# EAGLE schematic Ambisonic Clock Decoder With Phase Shifted Crosstalk Cancellation (EAGLE 9.0.1)

## Sheet 1 of 5: CLOCK (1 OF 5) stereo in, uhj decoder, b out
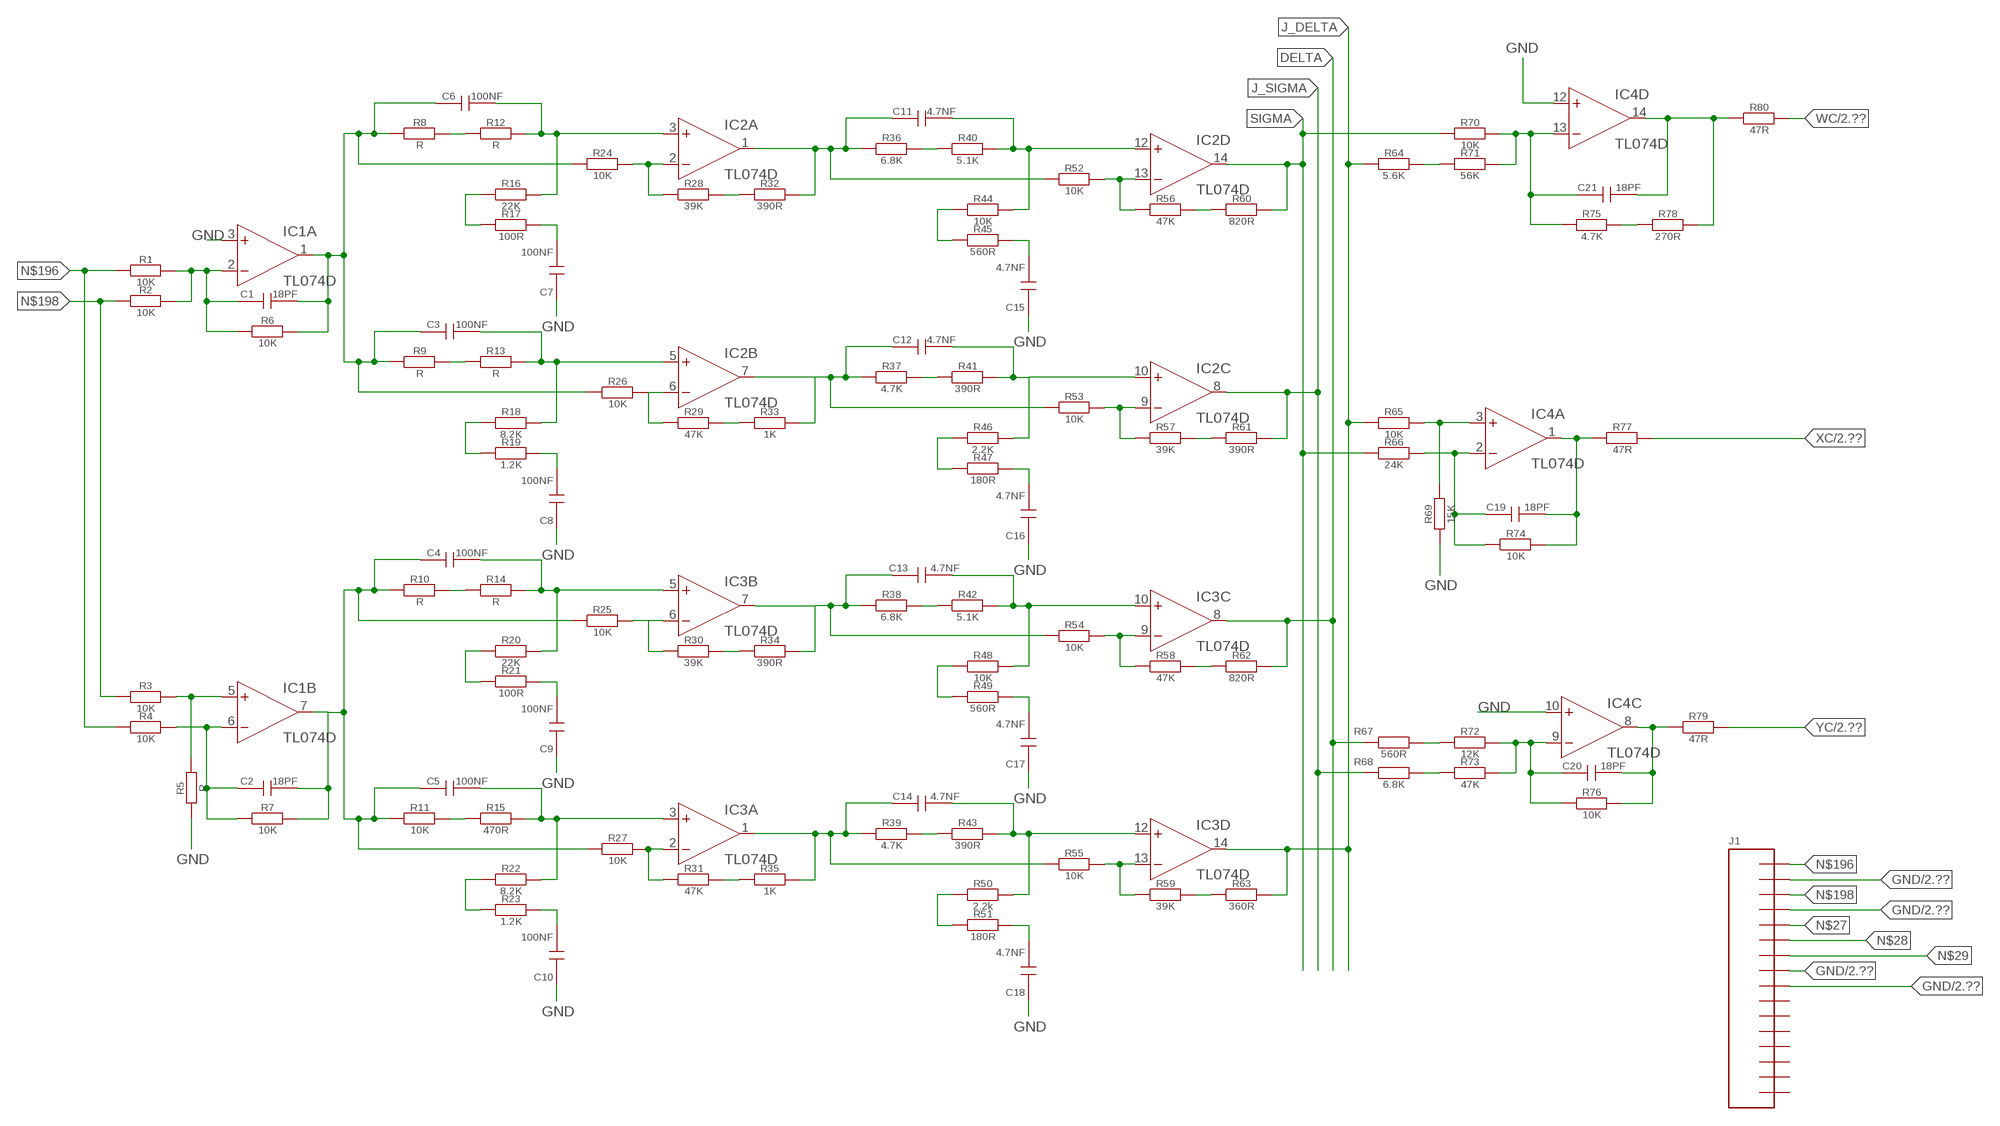
[diagram p0: schematic, sheet 1]

### Parts
C1  18PF  C  [CT6032]
C2  18PF  C  [CT6032]
C3  100NF  C  [CT6032]
C4  100NF  C  [CT6032]
C5  100NF  C  [CT6032]
C6  100NF  C  [CT6032]
C7  100NF  C  [CT6032]
C8  100NF  C  [CT6032]
C9  100NF  C  [CT6032]
C10  100NF  C  [CT6032]
C11  4.7NF  C  [CT6032]
C12  4.7NF  C  [CT6032]
C13  4.7NF  C  [CT6032]
C14  4.7NF  C  [CT6032]
C15  4.7NF  C  [CT6032]
C16  4.7NF  C  [CT6032]
C17  4.7NF  C  [CT6032]
C18  4.7NF  C  [CT6032]
C19  18PF  C  [CT6032]
C20  18PF  C  [CT6032]
C21  18PF  C  [CT6032]
IC1  TL074D  [SO14]
IC2  TL074D  [SO14]
IC3  TL074D  [SO14]
IC4  TL074D  [SO14]
J1  CON_16  [2X08SMT]
R1  10K  R  [R6332W]
R2  10K  R  [R6332W]
R3  10K  R  [R6332W]
R4  10K  R  [R6332W]
R5  R  [R6332W]
R6  10K  R  [R6332W]
R7  10K  R  [R6332W]
R8  R  [R6332W]
R9  R  [R6332W]
R10  R  [R6332W]
R11  10K  R  [R6332W]
R12  R  [R6332W]
R13  R  [R6332W]
R14  R  [R6332W]
R15  470R  R  [R6332W]
R16  22K  R  [R6332W]
R17  100R  R  [R6332W]
R18  8.2K  R  [R6332W]
R19  1.2K  R  [R6332W]
R20  22K  R  [R6332W]
R21  100R  R  [R6332W]
R22  8.2K  R  [R6332W]
R23  1.2K  R  [R6332W]
R24  10K  R  [R6332W]
R25  10K  R  [R6332W]
R26  10K  R  [R6332W]
R27  10K  R  [R6332W]
R28  39K  R  [R6332W]
R29  47K  R  [R6332W]
R30  39K  R  [R6332W]
R31  47K  R  [R6332W]
R32  390R  R  [R6332W]
R33  1K  R  [R6332W]
R34  390R  R  [R6332W]
R35  1K  R  [R6332W]
R36  6.8K  R  [R6332W]
R37  4.7K  R  [R6332W]
R38  6.8K  R  [R6332W]
R39  4.7K  R  [R6332W]
R40  5.1K  R  [R6332W]
R41  390R  R  [R6332W]
R42  5.1K  R  [R6332W]
R43  390R  R  [R6332W]
R44  10K  R  [R6332W]
R45  560R  R  [R6332W]
R46  2.2K  R  [R6332W]
R47  180R  R  [R6332W]
R48  10K  R  [R6332W]
R49  560R  R  [R6332W]
R50  2.2k  R  [R6332W]
R51  180R  R  [R6332W]
R52  10K  R  [R6332W]
R53  10K  R  [R6332W]
R54  10K  R  [R6332W]
R55  10K  R  [R6332W]
R56  47K  R  [R6332W]
R57  39K  R  [R6332W]
R58  47K  R  [R6332W]
R59  39K  R  [R6332W]
R60  820R  R  [R6332W]
R61  390R  R  [R6332W]
R62  820R  R  [R6332W]
R63  360R  R  [R6332W]
R64  5.6K  R  [R6332W]
R65  10K  R  [R6332W]
R66  24K  R  [R6332W]
R67  560R  R  [R6332W]
R68  6.8K  R  [R6332W]
R69  15K  R  [R6332W]
R70  10K  R  [R6332W]
R71  56K  R  [R6332W]
R72  12K  R  [R6332W]
R73  47K  R  [R6332W]
R74  10K  R  [R6332W]
R75  4.7K  R  [R6332W]
R76  10K  R  [R6332W]
R77  47R  R  [R6332W]
R78  270R  R  [R6332W]
R79  47R  R  [R6332W]
R80  47R  R  [R6332W]

### Nets
DELTA: IC3.8(C:OUT) R62.2 R67.1
GND: C7.+ C8.+ C9.+ C10.+ C15.+ C16.+ C17.+ C18.+ IC1.3(A:+IN) IC4.10(C:+IN) IC4.12(D:+IN) J1.2 J1.4 J1.8 J1.9 R5.1 R69.1 ; also sheet 2,4,5
J_DELTA: IC3.14(D:OUT) R63.2 R64.1 R65.1
J_SIGMA: IC2.8(C:OUT) R61.2 R68.1
N$1: R67.2 R72.1
N$2: R68.2 R73.1
N$4: C3.- IC2.5(B:+IN) R13.2 R18.2
N$27: J1.5
N$28: J1.6
N$29: J1.7
N$184: R16.1 R17.1
N$185: R8.2 R12.1
N$186: C7.- R17.2
N$187: C1.+ IC1.2(A:-IN) R1.2 R2.2 R6.1
N$188: C1.- C3.+ C6.+ IC1.1(A:OUT) R6.2 R8.1 R9.1 R24.1 R26.1
N$189: C6.- IC2.3(A:+IN) R12.2 R16.2
N$190: C2.+ IC1.6(B:-IN) R4.2 R7.1
N$191: C19.+ IC4.2(A:-IN) R66.2 R74.1
N$192: R28.2 R32.1
N$193: IC2.2(A:-IN) R24.2 R28.1
N$194: R10.2 R14.1
N$195: C11.+ IC2.1(A:OUT) R32.2 R36.1 R52.1
N$196: J1.1 R1.1 R4.1
N$197: R36.2 R40.1
N$198: J1.3 R2.1 R3.1
N$199: C11.- IC2.12(D:+IN) R40.2 R44.2
N$200: IC1.5(B:+IN) R3.2 R5.2
N$201: R44.1 R45.1
N$202: C15.- R45.2
N$203: IC2.13(D:-IN) R52.2 R56.1
N$204: R56.2 R60.1
N$206: R9.2 R13.1
N$208: R18.1 R19.1
N$209: C8.- R19.2
N$210: IC2.6(B:-IN) R26.2 R29.1
N$211: R29.2 R33.1
N$212: C12.+ IC2.7(B:OUT) R33.2 R37.1 R53.1
N$213: R37.2 R41.1
N$214: C12.- IC2.10(C:+IN) R41.2 R46.2
N$215: R46.1 R47.1
N$216: C16.- R47.2
N$217: IC2.9(C:-IN) R53.2 R57.1
N$218: R57.2 R61.1
N$220: C4.- IC3.5(B:+IN) R14.2 R20.2
N$221: R20.1 R21.1
N$222: C9.- R21.2
N$223: IC3.6(B:-IN) R25.2 R30.1
N$224: R30.2 R34.1
N$225: C13.+ IC3.7(B:OUT) R34.2 R38.1 R54.1
N$226: R38.2 R42.1
N$227: C13.- IC3.10(C:+IN) R42.2 R48.2
N$228: R48.1 R49.1
N$229: C17.- R49.2
N$230: IC3.9(C:-IN) R54.2 R58.1
N$231: R58.2 R62.1
N$233: R11.2 R15.1
N$234: C5.- IC3.3(A:+IN) R15.2 R22.2
N$235: R22.1 R23.1
N$236: C10.- R23.2
N$237: IC3.2(A:-IN) R27.2 R31.1
N$238: R31.2 R35.1
N$239: C14.+ IC3.1(A:OUT) R35.2 R39.1 R55.1
N$240: R39.2 R43.1
N$241: C14.- IC3.12(D:+IN) R43.2 R50.2
N$242: R50.1 R51.1
N$243: C18.- R51.2
N$244: IC3.13(D:-IN) R55.2 R59.1
N$245: R59.2 R63.1
N$247: C2.- C4.+ C5.+ IC1.7(B:OUT) R7.2 R10.1 R11.1 R25.1 R27.1
N$249: R64.2 R71.1
N$250: IC4.3(A:+IN) R65.2 R69.2
N$251: C19.- IC4.1(A:OUT) R74.2 R77.1
N$252: C21.+ IC4.13(D:-IN) R70.2 R71.2 R75.1
N$253: R75.2 R78.1
N$255: C21.- IC4.14(D:OUT) R78.2 R80.1
N$256: C20.+ IC4.9(C:-IN) R72.2 R73.2 R76.1
N$259: C20.- IC4.8(C:OUT) R76.2 R79.1
SIGMA: IC2.14(D:OUT) R60.2 R66.1 R70.1
WC: R80.2 ; also sheet 2,4
XC: R77.2 ; also sheet 2,4
YC: R79.2 ; also sheet 2,4
Unconnected: IC1.8(C:OUT) IC1.9(C:-IN) IC1.10(C:+IN) IC1.12(D:+IN) IC1.13(D:-IN) IC1.14(D:OUT) IC4.5(B:+IN) IC4.6(B:-IN) IC4.7(B:OUT) J1.10 J1.11 J1.12 J1.13 J1.14 J1.15 J1.16

## Sheet 2 of 5: CLOCK (2 OF 5) speaker phase shifters
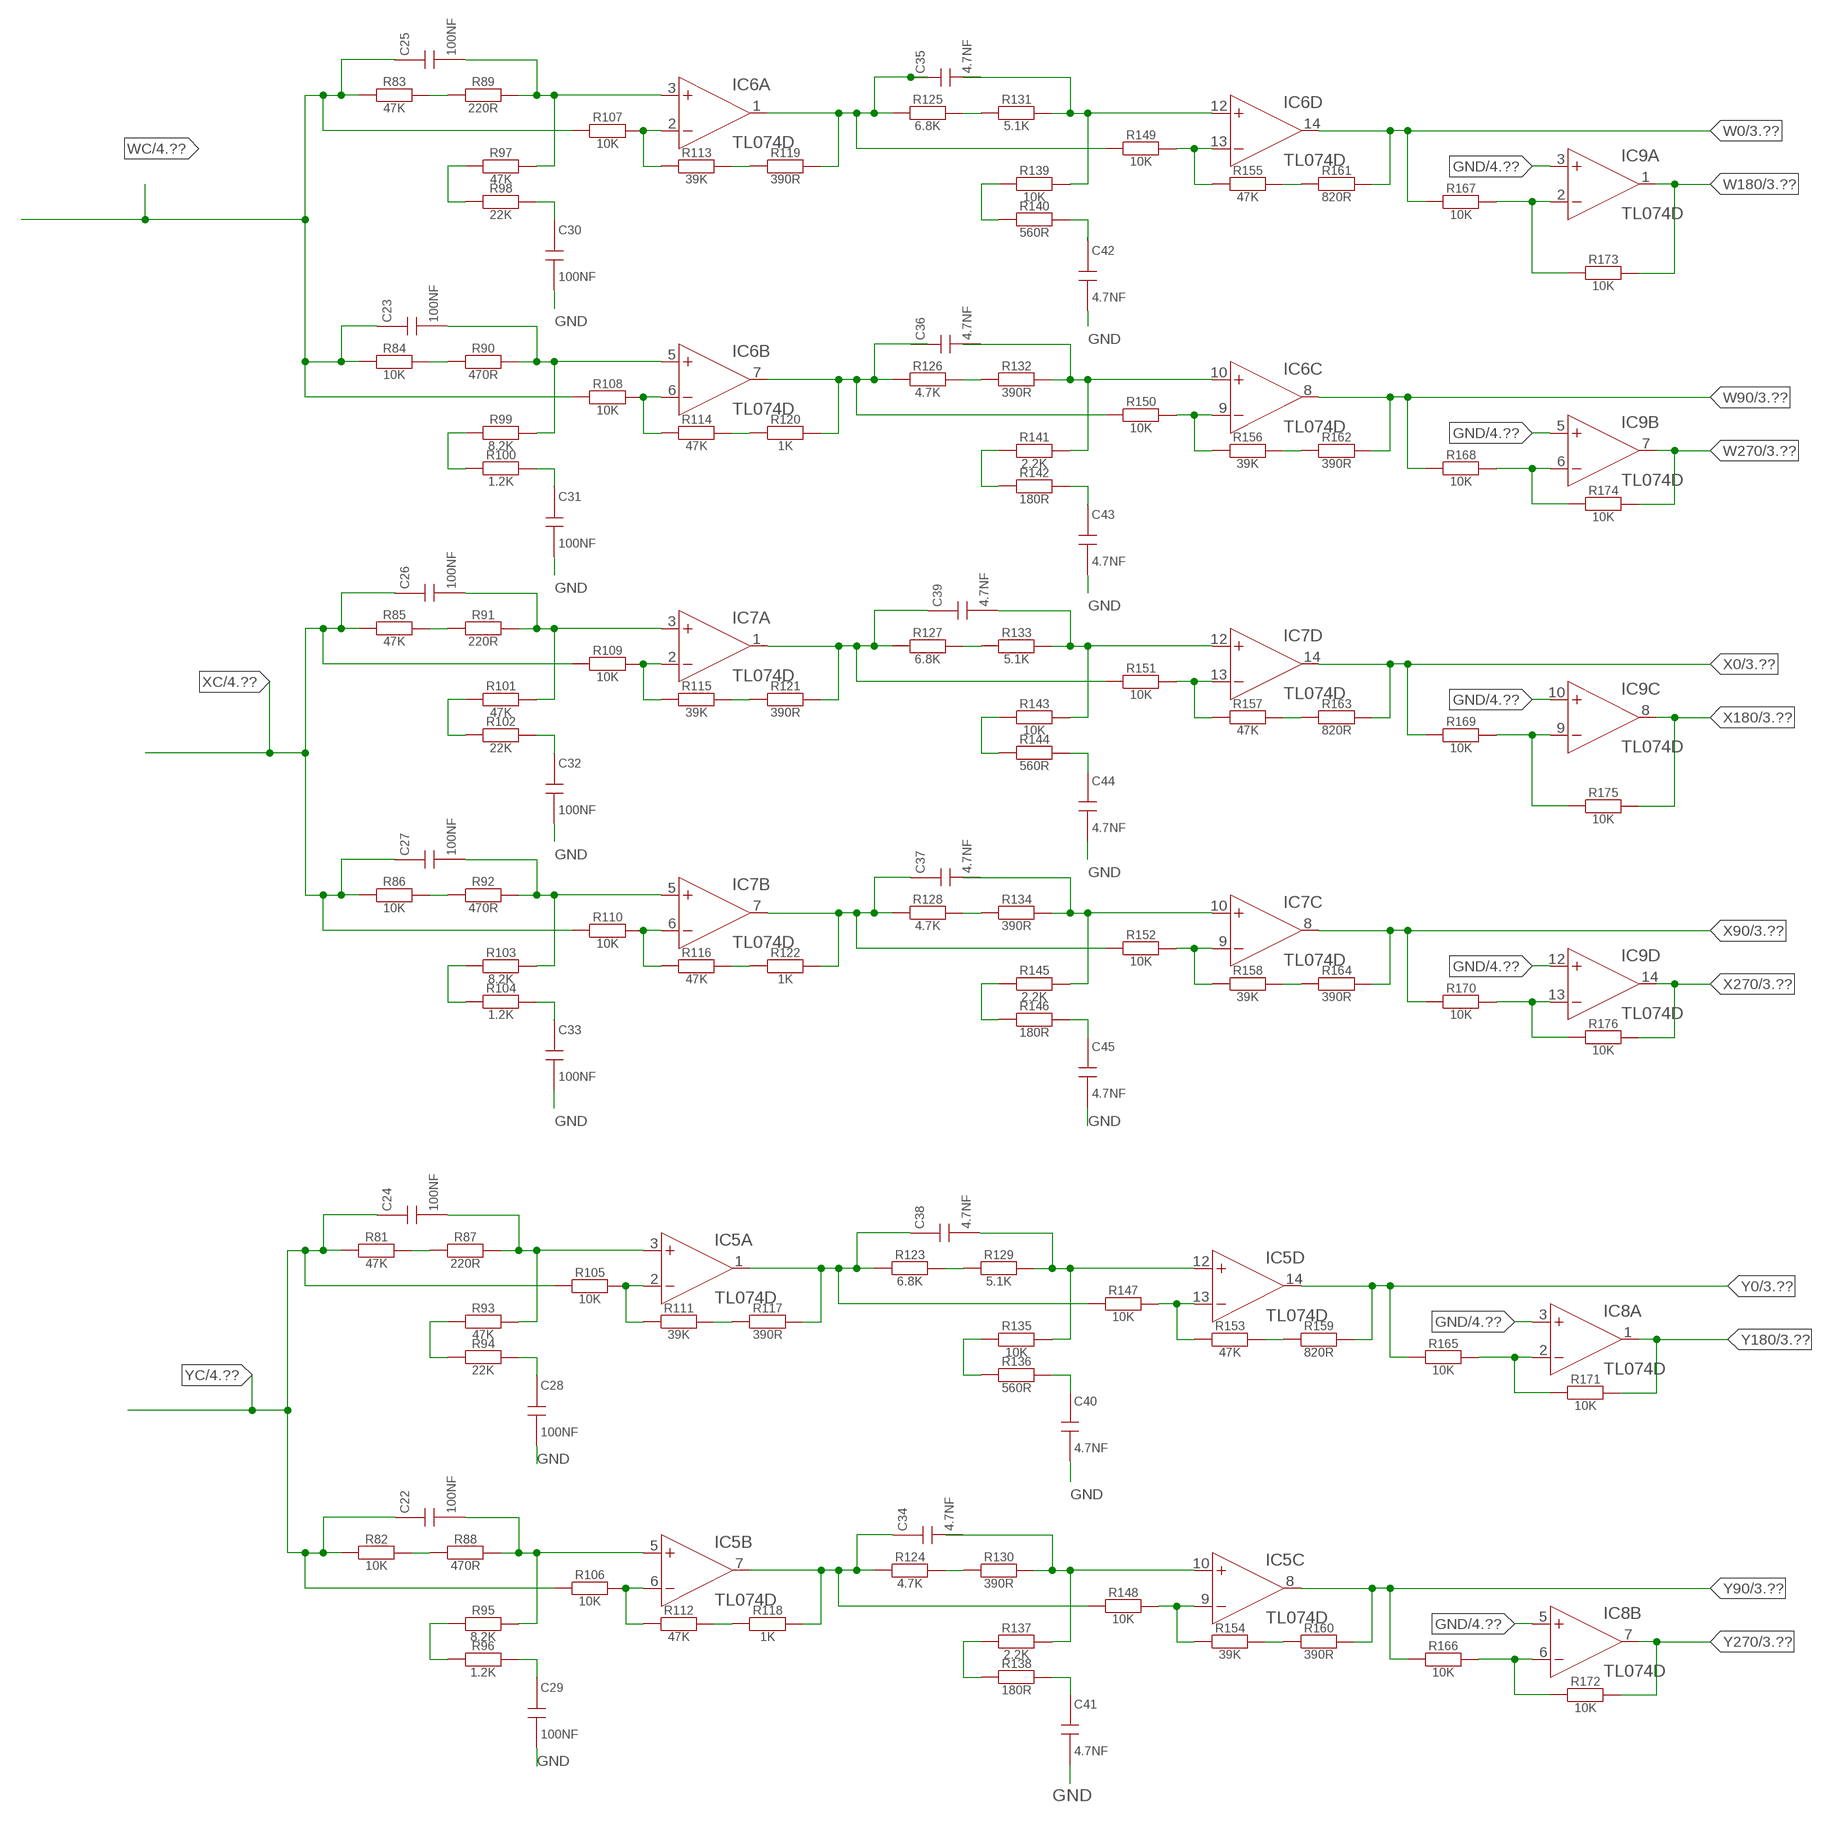
[diagram p1: schematic, sheet 2]

### Parts
C22  100NF  C  [CT6032]
C23  100NF  C  [CT6032]
C24  100NF  C  [CT6032]
C25  100NF  C  [CT6032]
C26  100NF  C  [CT6032]
C27  100NF  C  [CT6032]
C28  100NF  C  [CT6032]
C29  100NF  C  [CT6032]
C30  100NF  C  [CT6032]
C31  100NF  C  [CT6032]
C32  100NF  C  [CT6032]
C33  100NF  C  [CT6032]
C34  4.7NF  C  [CT6032]
C35  4.7NF  C  [CT6032]
C36  4.7NF  C  [CT6032]
C37  4.7NF  C  [CT6032]
C38  4.7NF  C  [CT6032]
C39  4.7NF  C  [CT6032]
C40  4.7NF  C  [CT6032]
C41  4.7NF  C  [CT6032]
C42  4.7NF  C  [CT6032]
C43  4.7NF  C  [CT6032]
C44  4.7NF  C  [CT6032]
C45  4.7NF  C  [CT6032]
IC5  TL074D  [SO14]
IC6  TL074D  [SO14]
IC7  TL074D  [SO14]
IC8  TL074D  [SO14]
IC9  TL074D  [SO14]
R81  47K  R  [R6332W]
R82  10K  R  [R6332W]
R83  47K  R  [R6332W]
R84  10K  R  [R6332W]
R85  47K  R  [R6332W]
R86  10K  R  [R6332W]
R87  220R  R  [R6332W]
R88  470R  R  [R6332W]
R89  220R  R  [R6332W]
R90  470R  R  [R6332W]
R91  220R  R  [R6332W]
R92  470R  R  [R6332W]
R93  47K  R  [R6332W]
R94  22K  R  [R6332W]
R95  8.2K  R  [R6332W]
R96  1.2K  R  [R6332W]
R97  47K  R  [R6332W]
R98  22K  R  [R6332W]
R99  8.2K  R  [R6332W]
R100  1.2K  R  [R6332W]
R101  47K  R  [R6332W]
R102  22K  R  [R6332W]
R103  8.2K  R  [R6332W]
R104  1.2K  R  [R6332W]
R105  10K  R  [R6332W]
R106  10K  R  [R6332W]
R107  10K  R  [R6332W]
R108  10K  R  [R6332W]
R109  10K  R  [R6332W]
R110  10K  R  [R6332W]
R111  39K  R  [R6332W]
R112  47K  R  [R6332W]
R113  39K  R  [R6332W]
R114  47K  R  [R6332W]
R115  39K  R  [R6332W]
R116  47K  R  [R6332W]
R117  390R  R  [R6332W]
R118  1K  R  [R6332W]
R119  390R  R  [R6332W]
R120  1K  R  [R6332W]
R121  390R  R  [R6332W]
R122  1K  R  [R6332W]
R123  6.8K  R  [R6332W]
R124  4.7K  R  [R6332W]
R125  6.8K  R  [R6332W]
R126  4.7K  R  [R6332W]
R127  6.8K  R  [R6332W]
R128  4.7K  R  [R6332W]
R129  5.1K  R  [R6332W]
R130  390R  R  [R6332W]
R131  5.1K  R  [R6332W]
R132  390R  R  [R6332W]
R133  5.1K  R  [R6332W]
R134  390R  R  [R6332W]
R135  10K  R  [R6332W]
R136  560R  R  [R6332W]
R137  2.2K  R  [R6332W]
R138  180R  R  [R6332W]
R139  10K  R  [R6332W]
R140  560R  R  [R6332W]
R141  2.2K  R  [R6332W]
R142  180R  R  [R6332W]
R143  10K  R  [R6332W]
R144  560R  R  [R6332W]
R145  2.2K  R  [R6332W]
R146  180R  R  [R6332W]
R147  10K  R  [R6332W]
R148  10K  R  [R6332W]
R149  10K  R  [R6332W]
R150  10K  R  [R6332W]
R151  10K  R  [R6332W]
R152  10K  R  [R6332W]
R153  47K  R  [R6332W]
R154  39K  R  [R6332W]
R155  47K  R  [R6332W]
R156  39K  R  [R6332W]
R157  47K  R  [R6332W]
R158  39K  R  [R6332W]
R159  820R  R  [R6332W]
R160  390R  R  [R6332W]
R161  820R  R  [R6332W]
R162  390R  R  [R6332W]
R163  820R  R  [R6332W]
R164  390R  R  [R6332W]
R165  10K  R  [R6332W]
R166  10K  R  [R6332W]
R167  10K  R  [R6332W]
R168  10K  R  [R6332W]
R169  10K  R  [R6332W]
R170  10K  R  [R6332W]
R171  10K  R  [R6332W]
R172  10K  R  [R6332W]
R173  10K  R  [R6332W]
R174  10K  R  [R6332W]
R175  10K  R  [R6332W]
R176  10K  R  [R6332W]

### Nets
GND: C28.- C29.- C30.- C31.- C32.- C33.- C40.- C41.- C42.- C43.- C44.- C45.- IC8.3(A:+IN) IC8.5(B:+IN) IC9.3(A:+IN) IC9.5(B:+IN) IC9.10(C:+IN) IC9.12(D:+IN) ; also sheet 1,4,5
N$25: R82.2 R88.1
N$31: R95.1 R96.1
N$32: C29.+ R96.2
N$40: IC5.6(B:-IN) R106.2 R112.1
N$42: R112.2 R118.1
N$43: C34.+ IC5.7(B:OUT) R118.2 R124.1 R148.1
N$51: R124.2 R130.1
N$61: R137.1 R138.1
N$62: C41.+ R138.2
N$67: IC5.9(C:-IN) R148.2 R154.1
N$68: R154.2 R160.1
N$80: R81.2 R87.1
N$89: R93.1 R94.1
N$95: C28.+ R94.2
N$100: IC5.2(A:-IN) R105.2 R111.1
N$121: R111.2 R117.1
N$126: C38.+ IC5.1(A:OUT) R117.2 R123.1 R147.1
N$130: R123.2 R129.1
N$148: R135.1 R136.1
N$153: C40.+ R136.2
N$161: IC5.13(D:-IN) R147.2 R153.1
N$168: R153.2 R159.1
N$170: R84.2 R90.1
N$205: R99.1 R100.1
N$232: C31.+ R100.2
N$246: IC6.6(B:-IN) R108.2 R114.1
N$260: R114.2 R120.1
N$261: C36.+ IC6.7(B:OUT) R120.2 R126.1 R150.1
N$262: R126.2 R132.1
N$264: R141.1 R142.1
N$265: C43.+ R142.2
N$266: IC6.9(C:-IN) R150.2 R156.1
N$267: R156.2 R162.1
N$269: R83.2 R89.1
N$271: R97.1 R98.1
N$272: IC8.6(B:-IN) R166.2 R172.1
N$273: C30.+ R98.2
N$274: IC6.2(A:-IN) R107.2 R113.1
N$275: R113.2 R119.1
N$276: C35.+ IC6.1(A:OUT) R119.2 R125.1 R149.1
N$277: R125.2 R131.1
N$279: R139.1 R140.1
N$280: C42.+ R140.2
N$281: IC6.13(D:-IN) R149.2 R155.1
N$282: R155.2 R161.1
N$289: IC8.2(A:-IN) R165.2 R171.1
N$291: R86.2 R92.1
N$292: C27.- IC7.5(B:+IN) R92.2 R103.2
N$293: R103.1 R104.1
N$294: C33.+ R104.2
N$295: IC7.6(B:-IN) R110.2 R116.1
N$296: R116.2 R122.1
N$297: C37.+ IC7.7(B:OUT) R122.2 R128.1 R152.1
N$298: R128.2 R134.1
N$300: R145.1 R146.1
N$301: C45.+ R146.2
N$302: IC7.9(C:-IN) R152.2 R158.1
N$303: R158.2 R164.1
N$306: IC9.13(D:-IN) R170.2 R176.1
N$308: R85.2 R91.1
N$310: R101.1 R102.1
N$311: C32.+ R102.2
N$312: IC7.2(A:-IN) R109.2 R115.1
N$313: R115.2 R121.1
N$314: C39.+ IC7.1(A:OUT) R121.2 R127.1 R151.1
N$315: R127.2 R133.1
N$317: R143.1 R144.1
N$318: C44.+ R144.2
N$319: IC7.13(D:-IN) R151.2 R157.1
N$320: R157.2 R163.1
N$322: IC9.9(C:-IN) R169.2 R175.1
N$338: IC9.6(B:-IN) R168.2 R174.1
N$354: IC9.2(A:-IN) R167.2 R173.1
N$777: C26.- IC7.3(A:+IN) R91.2 R101.2
N$778: C22.- IC5.5(B:+IN) R88.2 R95.2
N$779: C24.- IC5.3(A:+IN) R87.2 R93.2
N$780: C23.- IC6.5(B:+IN) R90.2 R99.2
N$781: C25.- IC6.3(A:+IN) R89.2 R97.2
N$782: C35.- IC6.12(D:+IN) R131.2 R139.2
N$783: C36.- IC6.10(C:+IN) R132.2 R141.2
N$784: C38.- IC5.12(D:+IN) R129.2 R135.2
N$785: C34.- IC5.10(C:+IN) R130.2 R137.2
N$787: C37.- IC7.10(C:+IN) R134.2 R145.2
N$788: C39.- IC7.12(D:+IN) R133.2 R143.2
W0: IC6.14(D:OUT) R161.2 R167.1 ; also sheet 3
W90: IC6.8(C:OUT) R162.2 R168.1 ; also sheet 3
W180: IC9.1(A:OUT) R173.2 ; also sheet 3
W270: IC9.7(B:OUT) R174.2 ; also sheet 3
WC: C23.+ C25.+ R83.1 R84.1 R107.1 R108.1 ; also sheet 1,4
X0: IC7.14(D:OUT) R163.2 R169.1 ; also sheet 3
X90: IC7.8(C:OUT) R164.2 R170.1 ; also sheet 3
X180: IC9.8(C:OUT) R175.2 ; also sheet 3
X270: IC9.14(D:OUT) R176.2 ; also sheet 3
XC: C26.+ C27.+ R85.1 R86.1 R109.1 R110.1 ; also sheet 1,4
Y0: IC5.14(D:OUT) R159.2 R165.1 ; also sheet 3
Y90: IC5.8(C:OUT) R160.2 R166.1 ; also sheet 3
Y180: IC8.1(A:OUT) R171.2 ; also sheet 3
Y270: IC8.7(B:OUT) R172.2 ; also sheet 3
YC: C22.+ C24.+ R81.1 R82.1 R105.1 R106.1 ; also sheet 1,4
Unconnected: IC8.8(C:OUT) IC8.9(C:-IN) IC8.10(C:+IN) IC8.12(D:+IN) IC8.13(D:-IN) IC8.14(D:OUT)

## Sheet 3 of 5: CLOCK (3 OF 5) phase shifted speaker feed resistor matrix
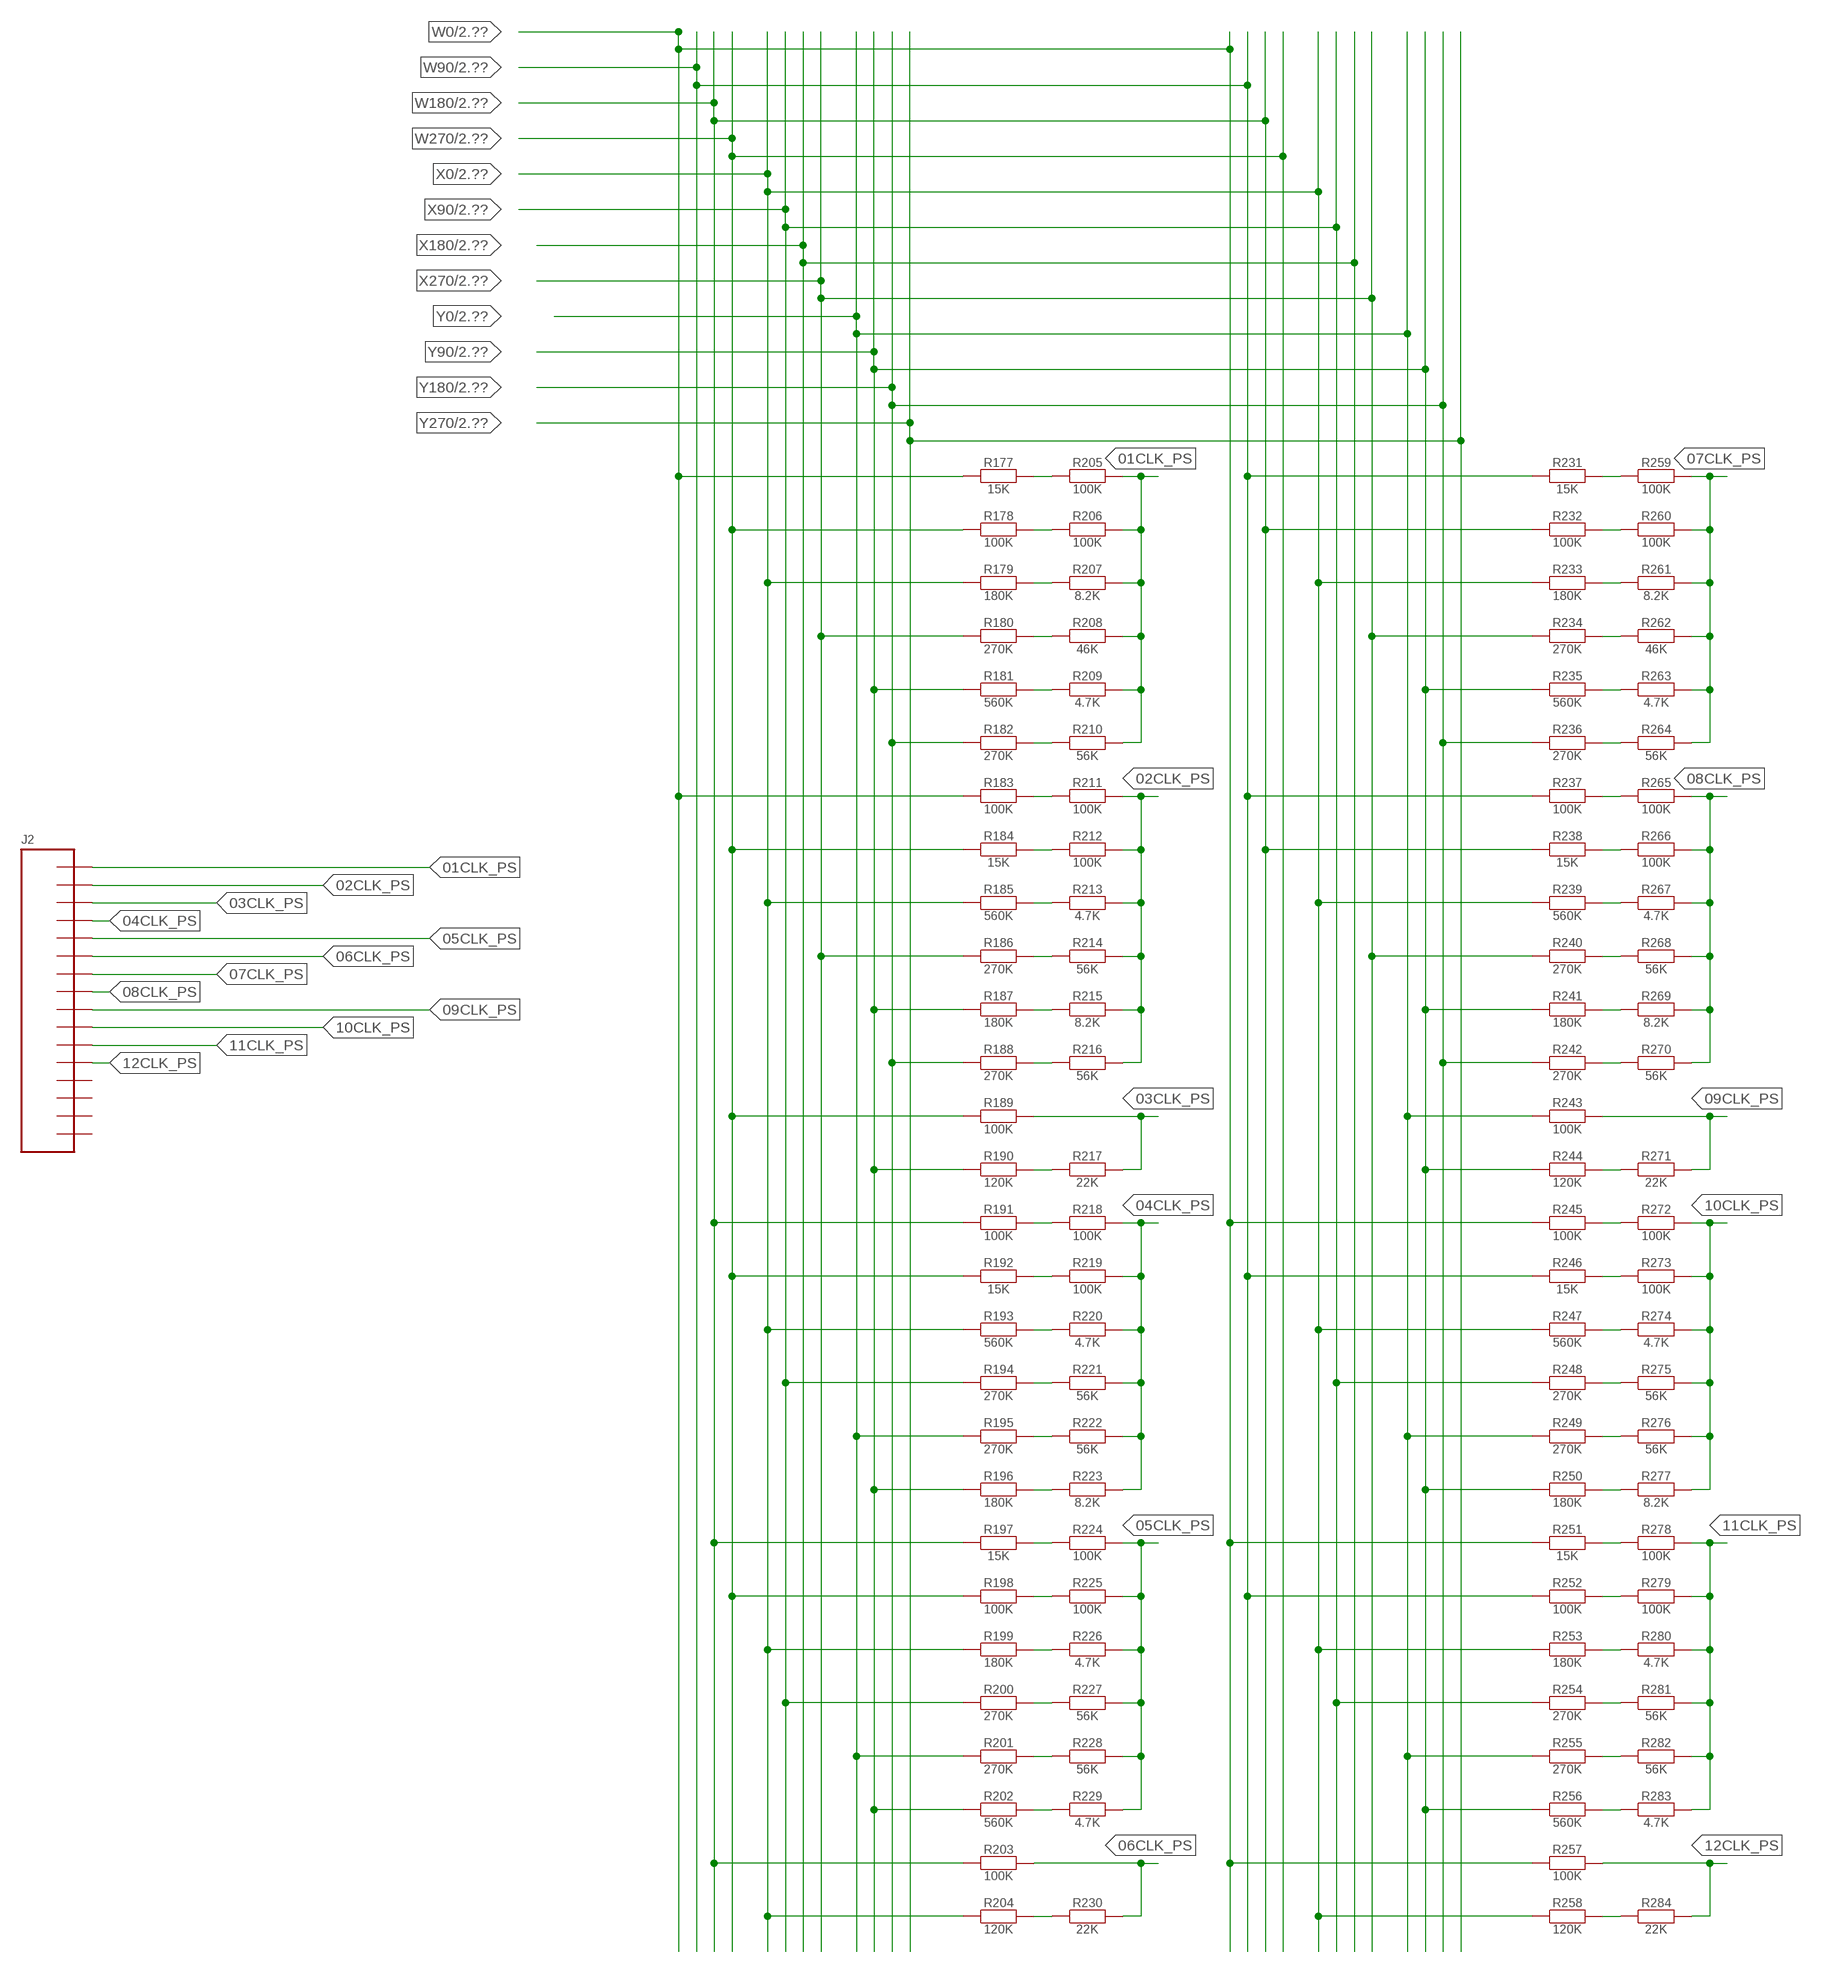
[diagram p2: schematic, sheet 3]

### Parts
J2  CON_16  [2X08SMT]
R177  15K  R  [R6332W]
R178  100K  R  [R6332W]
R179  180K  R  [R6332W]
R180  270K  R  [R6332W]
R181  560K  R  [R6332W]
R182  270K  R  [R6332W]
R183  100K  R  [R6332W]
R184  15K  R  [R6332W]
R185  560K  R  [R6332W]
R186  270K  R  [R6332W]
R187  180K  R  [R6332W]
R188  270K  R  [R6332W]
R189  100K  R  [R6332W]
R190  120K  R  [R6332W]
R191  100K  R  [R6332W]
R192  15K  R  [R6332W]
R193  560K  R  [R6332W]
R194  270K  R  [R6332W]
R195  270K  R  [R6332W]
R196  180K  R  [R6332W]
R197  15K  R  [R6332W]
R198  100K  R  [R6332W]
R199  180K  R  [R6332W]
R200  270K  R  [R6332W]
R201  270K  R  [R6332W]
R202  560K  R  [R6332W]
R203  100K  R  [R6332W]
R204  120K  R  [R6332W]
R205  100K  R  [R6332W]
R206  100K  R  [R6332W]
R207  8.2K  R  [R6332W]
R208  46K  R  [R6332W]
R209  4.7K  R  [R6332W]
R210  56K  R  [R6332W]
R211  100K  R  [R6332W]
R212  100K  R  [R6332W]
R213  4.7K  R  [R6332W]
R214  56K  R  [R6332W]
R215  8.2K  R  [R6332W]
R216  56K  R  [R6332W]
R217  22K  R  [R6332W]
R218  100K  R  [R6332W]
R219  100K  R  [R6332W]
R220  4.7K  R  [R6332W]
R221  56K  R  [R6332W]
R222  56K  R  [R6332W]
R223  8.2K  R  [R6332W]
R224  100K  R  [R6332W]
R225  100K  R  [R6332W]
R226  4.7K  R  [R6332W]
R227  56K  R  [R6332W]
R228  56K  R  [R6332W]
R229  4.7K  R  [R6332W]
R230  22K  R  [R6332W]
R231  15K  R  [R6332W]
R232  100K  R  [R6332W]
R233  180K  R  [R6332W]
R234  270K  R  [R6332W]
R235  560K  R  [R6332W]
R236  270K  R  [R6332W]
R237  100K  R  [R6332W]
R238  15K  R  [R6332W]
R239  560K  R  [R6332W]
R240  270K  R  [R6332W]
R241  180K  R  [R6332W]
R242  270K  R  [R6332W]
R243  100K  R  [R6332W]
R244  120K  R  [R6332W]
R245  100K  R  [R6332W]
R246  15K  R  [R6332W]
R247  560K  R  [R6332W]
R248  270K  R  [R6332W]
R249  270K  R  [R6332W]
R250  180K  R  [R6332W]
R251  15K  R  [R6332W]
R252  100K  R  [R6332W]
R253  180K  R  [R6332W]
R254  270K  R  [R6332W]
R255  270K  R  [R6332W]
R256  560K  R  [R6332W]
R257  100K  R  [R6332W]
R258  120K  R  [R6332W]
R259  100K  R  [R6332W]
R260  100K  R  [R6332W]
R261  8.2K  R  [R6332W]
R262  46K  R  [R6332W]
R263  4.7K  R  [R6332W]
R264  56K  R  [R6332W]
R265  100K  R  [R6332W]
R266  100K  R  [R6332W]
R267  4.7K  R  [R6332W]
R268  56K  R  [R6332W]
R269  8.2K  R  [R6332W]
R270  56K  R  [R6332W]
R271  22K  R  [R6332W]
R272  100K  R  [R6332W]
R273  100K  R  [R6332W]
R274  4.7K  R  [R6332W]
R275  56K  R  [R6332W]
R276  56K  R  [R6332W]
R277  8.2K  R  [R6332W]
R278  100K  R  [R6332W]
R279  100K  R  [R6332W]
R280  4.7K  R  [R6332W]
R281  56K  R  [R6332W]
R282  56K  R  [R6332W]
R283  4.7K  R  [R6332W]
R284  22K  R  [R6332W]

### Nets
01CLK_PS: J2.1 R205.2 R206.2 R207.2 R208.2 R209.2 R210.2
02CLK_PS: J2.2 R211.2 R212.2 R213.2 R214.2 R215.2 R216.2
03CLK_PS: J2.3 R189.2 R217.2
04CLK_PS: J2.4 R218.2 R219.2 R220.2 R221.2 R222.2 R223.2
05CLK_PS: J2.5 R224.2 R225.2 R226.2 R227.2 R228.2 R229.2
06CLK_PS: J2.6 R203.2 R230.2
07CLK_PS: J2.7 R259.2 R260.2 R261.2 R262.2 R263.2 R264.2
08CLK_PS: J2.8 R265.2 R266.2 R267.2 R268.2 R269.2 R270.2
09CLK_PS: J2.9 R243.2 R271.2
10CLK_PS: J2.10 R272.2 R273.2 R274.2 R275.2 R276.2 R277.2
11CLK_PS: J2.11 R278.2 R279.2 R280.2 R281.2 R282.2 R283.2
12CLK_PS: J2.12 R257.2 R284.2
N$26: R237.2 R265.1
N$146: R238.2 R266.1
N$254: R239.2 R267.1
N$257: R240.2 R268.1
N$263: R241.2 R269.1
N$270: R242.2 R270.1
N$288: R244.2 R271.1
N$299: R231.2 R259.1
N$305: R232.2 R260.1
N$307: R233.2 R261.1
N$316: R234.2 R262.1
N$321: R235.2 R263.1
N$323: R236.2 R264.1
N$324: R251.2 R278.1
N$325: R252.2 R279.1
N$326: R253.2 R280.1
N$327: R254.2 R281.1
N$328: R255.2 R282.1
N$329: R256.2 R283.1
N$330: R258.2 R284.1
N$331: R245.2 R272.1
N$332: R246.2 R273.1
N$333: R247.2 R274.1
N$334: R248.2 R275.1
N$335: R249.2 R276.1
N$336: R250.2 R277.1
N$360: R183.2 R211.1
N$361: R184.2 R212.1
N$366: R185.2 R213.1
N$367: R186.2 R214.1
N$372: R187.2 R215.1
N$373: R188.2 R216.1
N$379: R190.2 R217.1
N$385: R177.2 R205.1
N$386: R178.2 R206.1
N$391: R179.2 R207.1
N$392: R180.2 R208.1
N$397: R181.2 R209.1
N$398: R182.2 R210.1
N$404: R197.2 R224.1
N$405: R198.2 R225.1
N$410: R199.2 R226.1
N$411: R200.2 R227.1
N$416: R201.2 R228.1
N$417: R202.2 R229.1
N$423: R204.2 R230.1
N$431: R191.2 R218.1
N$432: R192.2 R219.1
N$437: R193.2 R220.1
N$438: R194.2 R221.1
N$443: R195.2 R222.1
N$444: R196.2 R223.1
W0: R177.1 R183.1 R245.1 R251.1 R257.1 ; also sheet 2
W90: R231.1 R237.1 R246.1 R252.1 ; also sheet 2
W180: R191.1 R197.1 R203.1 R232.1 R238.1 ; also sheet 2
W270: R178.1 R184.1 R189.1 R192.1 R198.1 ; also sheet 2
X0: R179.1 R185.1 R193.1 R199.1 R204.1 R233.1 R239.1 R247.1 R253.1 R258.1 ; also sheet 2
X90: R194.1 R200.1 R248.1 R254.1 ; also sheet 2
X270: R180.1 R186.1 R234.1 R240.1 ; also sheet 2
Y0: R195.1 R201.1 R243.1 R249.1 R255.1 ; also sheet 2
Y90: R181.1 R187.1 R190.1 R196.1 R202.1 R235.1 R241.1 R244.1 R250.1 R256.1 ; also sheet 2
Y180: R182.1 R188.1 R236.1 R242.1 ; also sheet 2
Unconnected: J2.13 J2.14 J2.15 J2.16

## Sheet 4 of 5: CLOCK (4 OF 5) Normal Speaker Feed Resistor Matrix
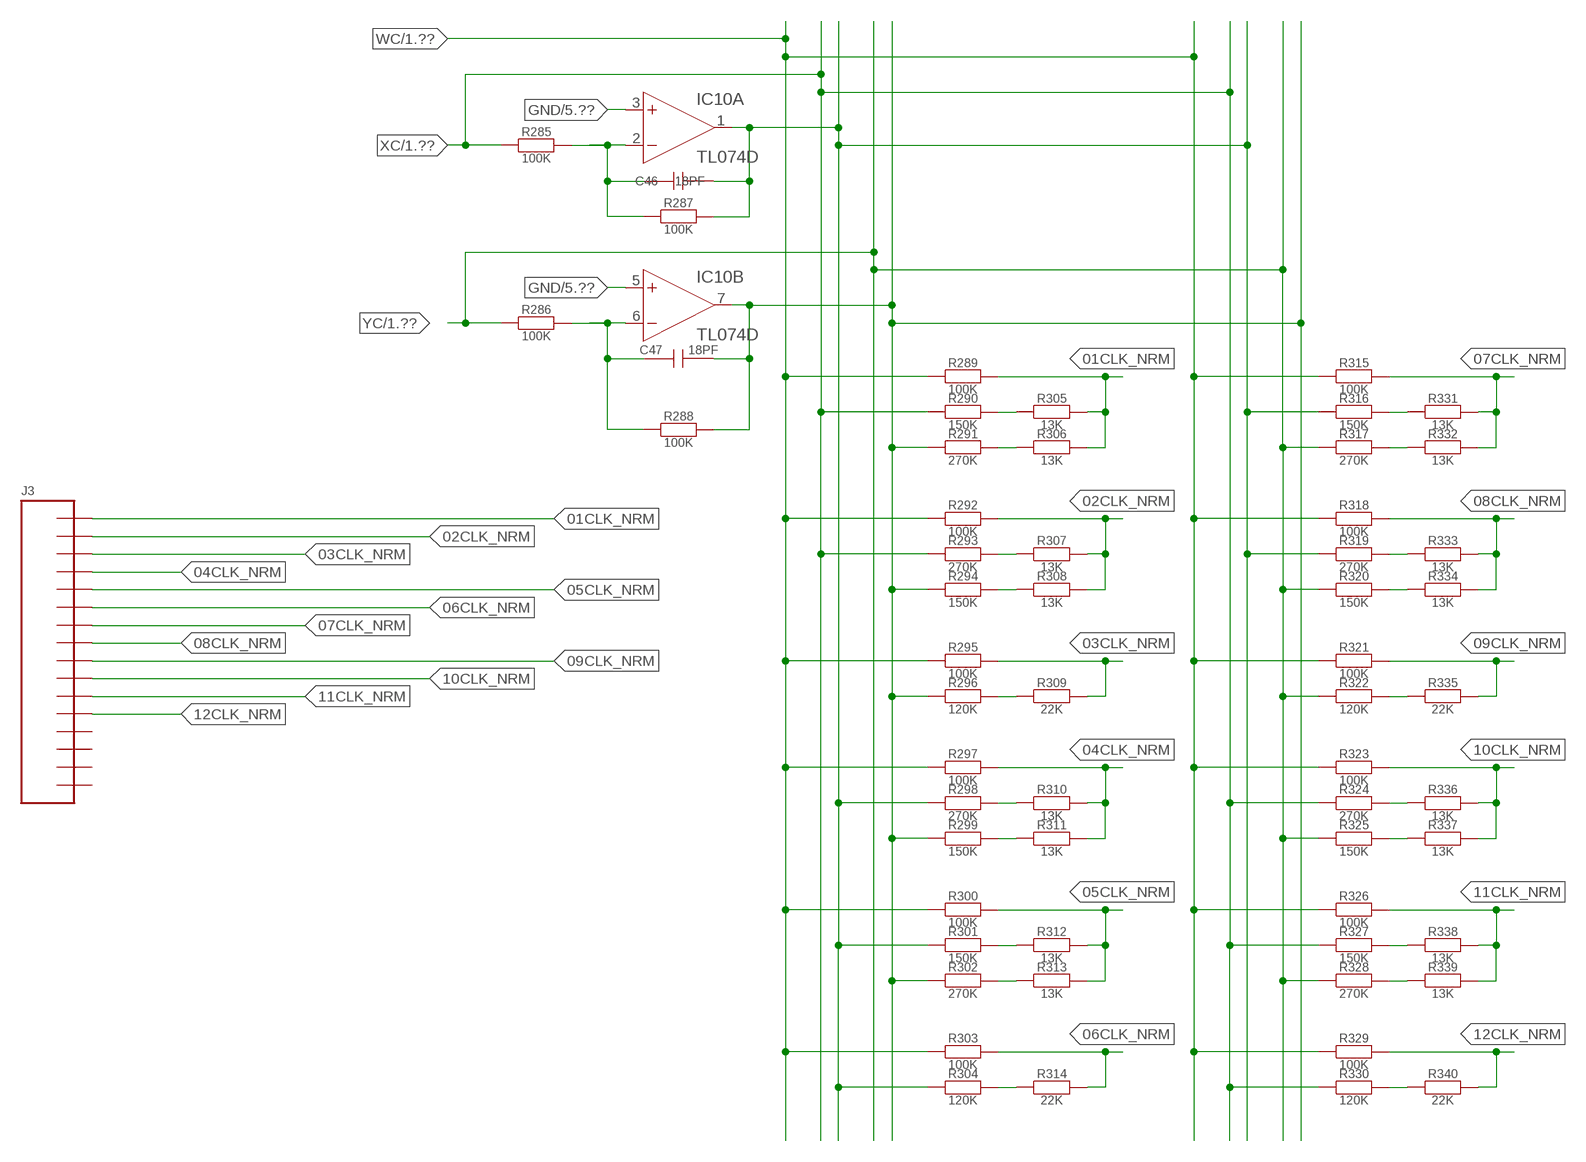
[diagram p3: schematic, sheet 4]

### Parts
C46  18PF  C  [CT6032]
C47  18PF  C  [CT6032]
IC10  TL074D  [SO14]
J3  CON_16  [2X08SMT]
R285  100K  R  [R6332W]
R286  100K  R  [R6332W]
R287  100K  R  [R6332W]
R288  100K  R  [R6332W]
R289  100K  R  [R6332W]
R290  150K  R  [R6332W]
R291  270K  R  [R6332W]
R292  100K  R  [R6332W]
R293  270K  R  [R6332W]
R294  150K  R  [R6332W]
R295  100K  R  [R6332W]
R296  120K  R  [R6332W]
R297  100K  R  [R6332W]
R298  270K  R  [R6332W]
R299  150K  R  [R6332W]
R300  100K  R  [R6332W]
R301  150K  R  [R6332W]
R302  270K  R  [R6332W]
R303  100K  R  [R6332W]
R304  120K  R  [R6332W]
R305  13K  R  [R6332W]
R306  13K  R  [R6332W]
R307  13K  R  [R6332W]
R308  13K  R  [R6332W]
R309  22K  R  [R6332W]
R310  13K  R  [R6332W]
R311  13K  R  [R6332W]
R312  13K  R  [R6332W]
R313  13K  R  [R6332W]
R314  22K  R  [R6332W]
R315  100K  R  [R6332W]
R316  150K  R  [R6332W]
R317  270K  R  [R6332W]
R318  100K  R  [R6332W]
R319  270K  R  [R6332W]
R320  150K  R  [R6332W]
R321  100K  R  [R6332W]
R322  120K  R  [R6332W]
R323  100K  R  [R6332W]
R324  270K  R  [R6332W]
R325  150K  R  [R6332W]
R326  100K  R  [R6332W]
R327  150K  R  [R6332W]
R328  270K  R  [R6332W]
R329  100K  R  [R6332W]
R330  120K  R  [R6332W]
R331  13K  R  [R6332W]
R332  13K  R  [R6332W]
R333  13K  R  [R6332W]
R334  13K  R  [R6332W]
R335  22K  R  [R6332W]
R336  13K  R  [R6332W]
R337  13K  R  [R6332W]
R338  13K  R  [R6332W]
R339  13K  R  [R6332W]
R340  22K  R  [R6332W]

### Nets
01CLK_NRM: J3.1 R289.2 R305.2 R306.2
02CLK_NRM: J3.2 R292.2 R307.2 R308.2
03CLK_NRM: J3.3 R295.2 R309.2
04CLK_NRM: J3.4 R297.2 R310.2 R311.2
05CLK_NRM: J3.5 R300.2 R312.2 R313.2
06CLK_NRM: J3.6 R303.2 R314.2
07CLK_NRM: J3.7 R315.2 R331.2 R332.2
08CLK_NRM: J3.8 R318.2 R333.2 R334.2
09CLK_NRM: J3.9 R321.2 R335.2
10CLK_NRM: J3.10 R323.2 R336.2 R337.2
11CLK_NRM: J3.11 R326.2 R338.2 R339.2
12CLK_NRM: J3.12 R329.2 R340.2
GND: IC10.3(A:+IN) IC10.5(B:+IN) ; also sheet 1,2,5
N$23: C46.+ IC10.2(A:-IN) R285.2 R287.1
N$60: C47.+ IC10.6(B:-IN) R286.2 R288.1
N$72: R316.2 R331.1
N$88: R317.2 R332.1
N$145: R319.2 R333.1
N$179: R320.2 R334.1
N$219: R322.2 R335.1
N$258: R324.2 R336.1
N$268: R325.2 R337.1
N$278: R327.2 R338.1
N$304: R328.2 R339.1
N$309: R330.2 R340.1
N$482: R291.2 R306.1
N$487: R290.2 R305.1
N$501: R293.2 R307.1
N$503: R294.2 R308.1
N$519: R296.2 R309.1
N$535: R298.2 R310.1
N$537: R299.2 R311.1
N$541: C47.- IC10.7(B:OUT) R288.2 R291.1 R294.1 R296.1 R299.1 R302.1
N$553: R301.2 R312.1
N$555: R302.2 R313.1
N$571: R304.2 R314.1
WC: R289.1 R292.1 R295.1 R297.1 R300.1 R303.1 R315.1 R318.1 R321.1 R323.1 R326.1 R329.1 ; also sheet 1,2
X1: C46.- IC10.1(A:OUT) R287.2 R298.1 R301.1 R304.1 R316.1 R319.1
XC: R285.1 R290.1 R293.1 R324.1 R327.1 R330.1 ; also sheet 1,2
YC: R286.1 R317.1 R320.1 R322.1 R325.1 R328.1 ; also sheet 1,2
Unconnected: J3.13 J3.14 J3.15 J3.16

## Sheet 5 of 5: CLOCK (5 OF 5) Matrix Sums and Output buffers
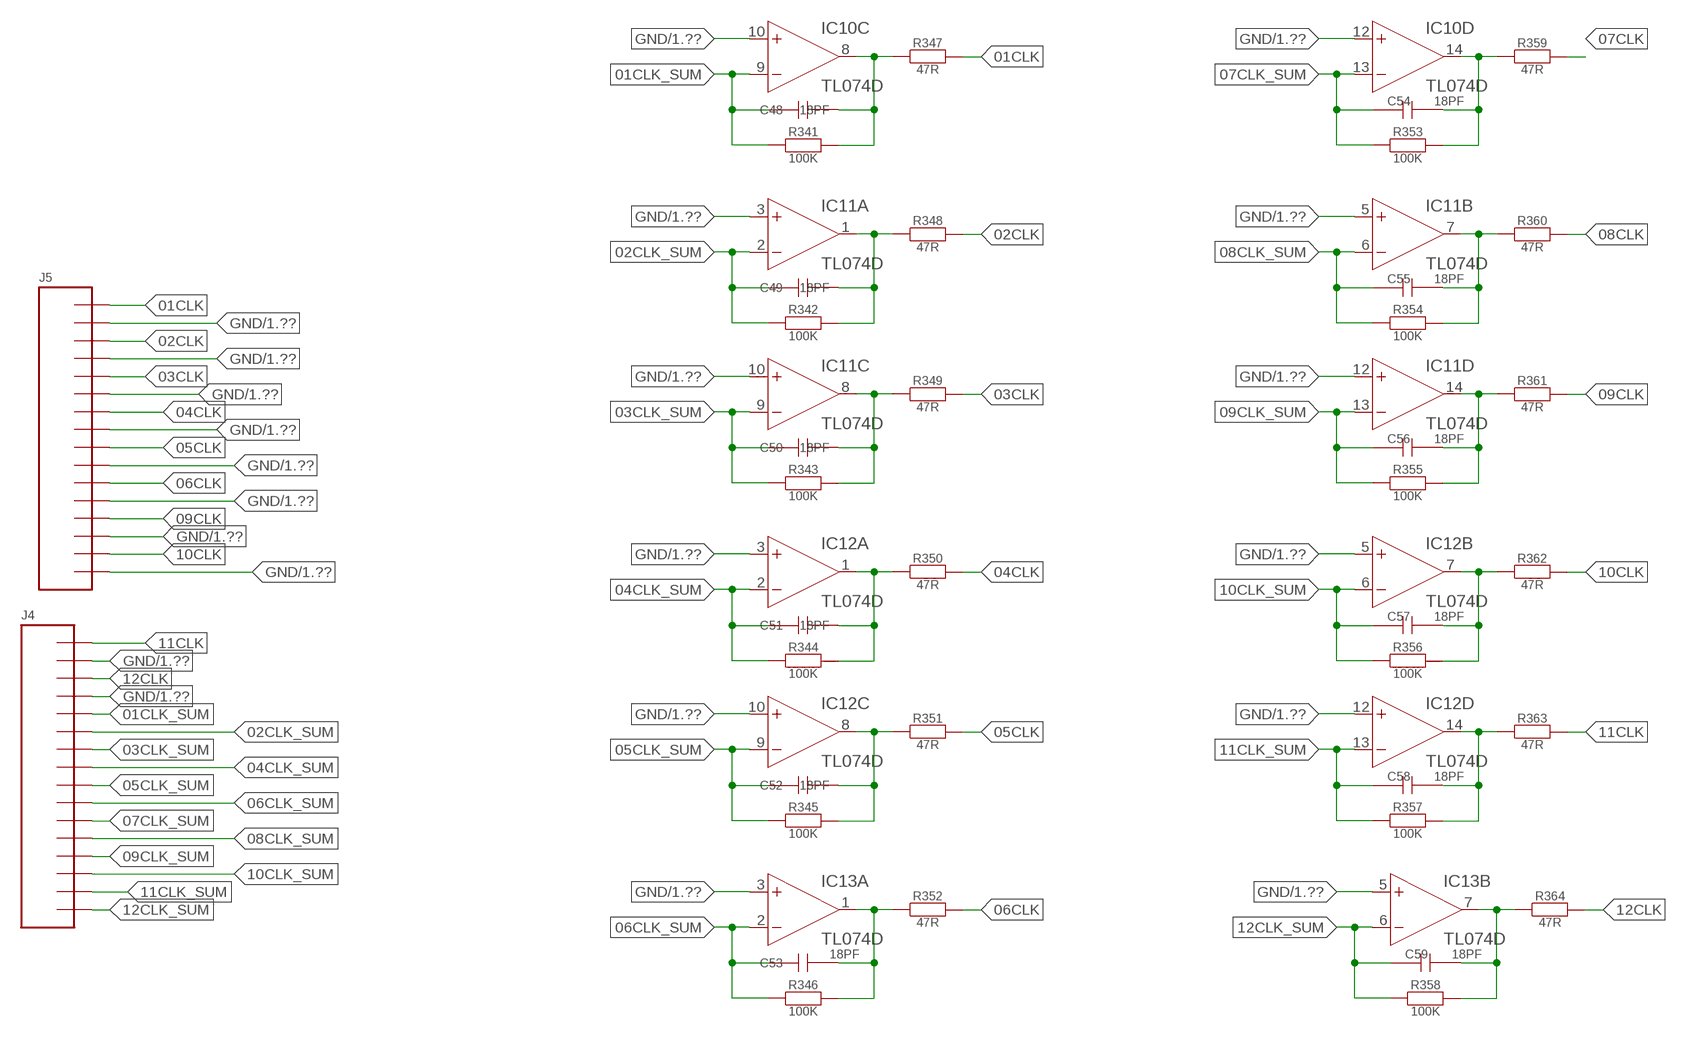
[diagram p4: schematic, sheet 5]

### Parts
C48  18PF  C  [CT6032]
C49  18PF  C  [CT6032]
C50  18PF  C  [CT6032]
C51  18PF  C  [CT6032]
C52  18PF  C  [CT6032]
C53  18PF  C  [CT6032]
C54  18PF  C  [CT6032]
C55  18PF  C  [CT6032]
C56  18PF  C  [CT6032]
C57  18PF  C  [CT6032]
C58  18PF  C  [CT6032]
C59  18PF  C  [CT6032]
IC11  TL074D  [SO14]
IC12  TL074D  [SO14]
IC13  TL074D  [SO14]
J4  CON_16  [2X08SMT]
J5  CON_16  [2X08SMT]
R341  100K  R  [R6332W]
R342  100K  R  [R6332W]
R343  100K  R  [R6332W]
R344  100K  R  [R6332W]
R345  100K  R  [R6332W]
R346  100K  R  [R6332W]
R347  47R  R  [R6332W]
R348  47R  R  [R6332W]
R349  47R  R  [R6332W]
R350  47R  R  [R6332W]
R351  47R  R  [R6332W]
R352  47R  R  [R6332W]
R353  100K  R  [R6332W]
R354  100K  R  [R6332W]
R355  100K  R  [R6332W]
R356  100K  R  [R6332W]
R357  100K  R  [R6332W]
R358  100K  R  [R6332W]
R359  47R  R  [R6332W]
R360  47R  R  [R6332W]
R361  47R  R  [R6332W]
R362  47R  R  [R6332W]
R363  47R  R  [R6332W]
R364  47R  R  [R6332W]

### Nets
01CLK: J5.1 R347.2
01CLK_SUM: C48.+ IC10.9(C:-IN) J4.5 R341.1
02CLK: J5.3 R348.2
02CLK_SUM: C49.+ IC11.2(A:-IN) J4.6 R342.1
03CLK: J5.5 R349.2
03CLK_SUM: C50.+ IC11.9(C:-IN) J4.7 R343.1
04CLK: J5.7 R350.2
04CLK_SUM: C51.+ IC12.2(A:-IN) J4.8 R344.1
05CLK: J5.9 R351.2
05CLK_SUM: C52.+ IC12.9(C:-IN) J4.9 R345.1
06CLK: J5.11 R352.2
06CLK_SUM: C53.+ IC13.2(A:-IN) J4.10 R346.1
07CLK: R359.2
07CLK_SUM: C54.+ IC10.13(D:-IN) J4.11 R353.1
08CLK: R360.2
08CLK_SUM: C55.+ IC11.6(B:-IN) J4.12 R354.1
09CLK: J5.13 R361.2
09CLK_SUM: C56.+ IC11.13(D:-IN) J4.13 R355.1
10CLK: J5.15 R362.2
10CLK_SUM: C57.+ IC12.6(B:-IN) J4.14 R356.1
11CLK: J4.1 R363.2
11CLK_SUM: C58.+ IC12.13(D:-IN) J4.15 R357.1
12CLK: J4.3 R364.2
12CLK_SUM: C59.+ IC13.6(B:-IN) J4.16 R358.1
GND: IC10.10(C:+IN) IC10.12(D:+IN) IC11.3(A:+IN) IC11.5(B:+IN) IC11.10(C:+IN) IC11.12(D:+IN) IC12.3(A:+IN) IC12.5(B:+IN) IC12.10(C:+IN) IC12.12(D:+IN) IC13.3(A:+IN) IC13.5(B:+IN) J4.2 J4.4 J5.2 J5.4 J5.6 J5.8 J5.10 J5.12 J5.14 J5.16 ; also sheet 1,2,4
N$447: C48.- IC10.8(C:OUT) R341.2 R347.1
N$450: C49.- IC11.1(A:OUT) R342.2 R348.1
N$453: C50.- IC11.8(C:OUT) R343.2 R349.1
N$456: C51.- IC12.1(A:OUT) R344.2 R350.1
N$459: C52.- IC12.8(C:OUT) R345.2 R351.1
N$462: C53.- IC13.1(A:OUT) R346.2 R352.1
N$465: C54.- IC10.14(D:OUT) R353.2 R359.1
N$468: C55.- IC11.7(B:OUT) R354.2 R360.1
N$471: C56.- IC11.14(D:OUT) R355.2 R361.1
N$474: C57.- IC12.7(B:OUT) R356.2 R362.1
N$477: C58.- IC12.14(D:OUT) R357.2 R363.1
N$480: C59.- IC13.7(B:OUT) R358.2 R364.1
Unconnected: IC13.8(C:OUT) IC13.9(C:-IN) IC13.10(C:+IN) IC13.12(D:+IN) IC13.13(D:-IN) IC13.14(D:OUT)

## Power pins joined to a net without a drawn wire
V+: IC1.4(P:V+) IC2.4(P:V+) IC3.4(P:V+) IC4.4(P:V+) IC5.4(P:V+) IC6.4(P:V+) IC7.4(P:V+) IC8.4(P:V+) IC9.4(P:V+) IC10.4(P:V+) IC11.4(P:V+) IC12.4(P:V+) IC13.4(P:V+)
V-: IC1.11(P:V-) IC2.11(P:V-) IC3.11(P:V-) IC4.11(P:V-) IC5.11(P:V-) IC6.11(P:V-) IC7.11(P:V-) IC8.11(P:V-) IC9.11(P:V-) IC10.11(P:V-) IC11.11(P:V-) IC12.11(P:V-) IC13.11(P:V-)

## Library data of the parts
C1-C59 = SMD:C
IC1-IC13 = SMD:TL074: OP AMP
J1-J5 = SMD:CON_16
R1-R364 = SMD:R